# EAGLE design Adafruit BME280 (EAGLE 8.4.0)
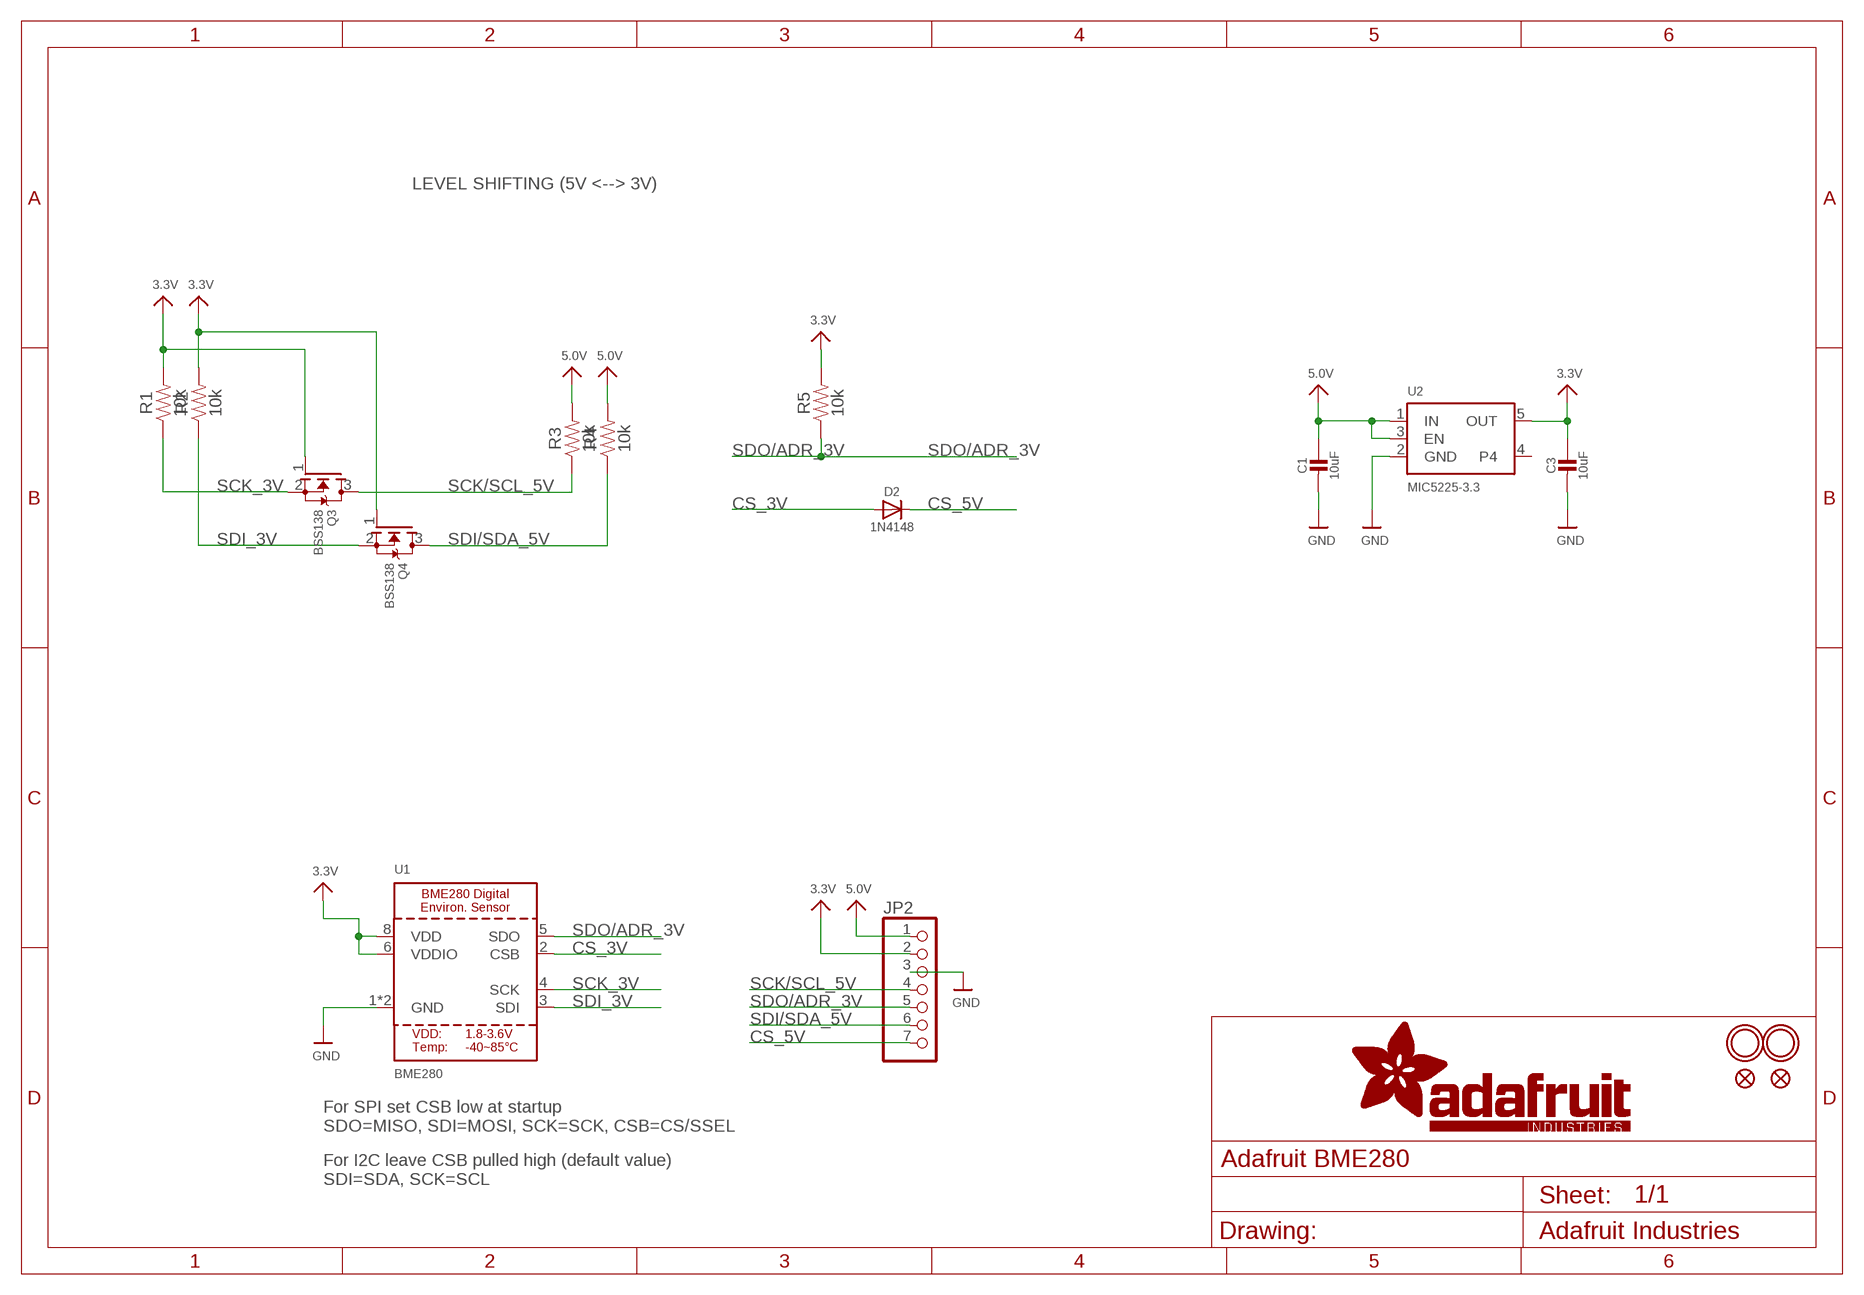
[diagram p0: schematic, sheet 1]

## Parts
C1  10uF  CAP_CERAMIC0805-NOOUTLINE  [0805-NO]
C3  10uF  CAP_CERAMIC0805-NOOUTLINE  [0805-NO]
D2  1N4148  DIODESOD-323  [SOD-323]
JP2  HEADER-1X770MIL  [1X07_ROUND_70]
Q3  BSS138  MOSFET-NWIDE  [SOT23-WIDE]
Q4  BSS138  MOSFET-NWIDE  [SOT23-WIDE]
R1  10k  10KOHM-0603-1/10W-1%  [0603]
R2  10k  10KOHM-0603-1/10W-1%  [0603]
R3  10k  10KOHM-0603-1/10W-1%  [0603]
R4  10k  10KOHM-0603-1/10W-1%  [0603]
R5  10k  10KOHM-0603-1/10W-1%  [0603]
U1  BME280  [BME280]
U2  MIC5225-3.3  VREG_SOT23-5  [SOT23-5]
U$5  FIDUCIAL""  [FIDUCIAL_1MM]
U$7  MOUNTINGHOLE2.0  [MOUNTINGHOLE_2.0_PLATED]
U$8  MOUNTINGHOLE2.0  [MOUNTINGHOLE_2.0_PLATED]
U$15  FIDUCIAL""  [FIDUCIAL_1MM]

## Nets
3.3V: C3.1 JP2.2 Q3.1(G) Q4.1(G) R1.2 R2.2 R5.2 U1.6(VDDIO) U1.8(VDD) U2.5(OUT)
5.0V: C1.1 JP2.1 R3.2 R4.2 U2.1(IN) U2.3(EN)
CS_3V: D2.A U1.2(CSB)
CS_5V: D2.C JP2.7
GND: C1.2 C3.2 JP2.3 U1.1(GND) U1.7(GND) U2.2(GND)
SCK/SCL_5V: JP2.4 Q3.3(D) R3.1
SCK_3V: Q3.2(S) R1.1 U1.4(SCK)
SDI/SDA_5V: JP2.6 Q4.3(D) R4.1
SDI_3V: Q4.2(S) R2.1 U1.3(SDI)
SDO/ADR_3V: JP2.5 R5.1 U1.5(SDO)
Unconnected: U2.4

## Notes on the sheet
- LEVEL SHIFTING (5V <--> 3V)
- For SPI set CSB low at startup
  SDO=MISO, SDI=MOSI, SCK=SCK, CSB=CS/SSEL
- For I2C leave CSB pulled high (default value)
  SDI=SDA, SCK=SCL

## Library data of the parts
C1 C3 = microbuilder:CAP_CERAMIC: Ceramic Capacitors For new designs, use the packages preceded by an '_' character since they are more reliable: The following footprints should be used on most boards: _0402 - Standard footprint for regular board layouts _0603 - Standard footprint for regular board layouts _0805 - Standard footprint for regular board layouts _1206 - Standard footprint for regular board layouts For extremely tight-pitch boards where space is at a premium, the following 'micro-pitch' footprints can be used (smaller pads, no silkscreen outline, etc.): _0402MP - Micro-pitch footprint for very dense/compact boards _0603MP - Micro-pitch footprint for very dense/compact boards _0805MP - Micro-pitch footprint for very dense/compact boards _1206MP - Micro-pitch footprint for very dense/compact boards
D2 = microbuilder:DIODE: Diode SMA Model Volts Amps Type Vf Ir Digikey # Notes SSA34-E3 40V 3A Schottky 480mV @ 3A 200uA @ 40V SSA34-E3/61TGITR-ND CDBA120-G 20V 1A Schottky 500mV @ 1A 500uA @ 20V 641-1014-6-ND REEL MBRA210 10V 2A Schottky 350mV @ 2A 700uA @ 10V MBRA210LT3 SOD-123 Model Volts Amps Type Vf Ir Order # Notes BAT54T1G 30V 200mA Schottky 800mV @ 200mA 2uA @ 25V BAT54T1GOSTR-ND B0530W 30V 500mA Schottky 430mV @ 500mA 130uA @ 30V B0530W-FDICT-ND REEL MBR120 20V 1A Schottky 340mV @ 1A MBR120VLSFT1GOSCT-ND SOD-323 Model Volts Amps Type Vf Ir Order # Notes PMEG2005EJ 20V 500mA Schottky 355mV @ 500mA 568-4110-1-ND ZLLS410 10V 570mA Schottky 380mV @ 570mA ZLLS410CT-ND 1N4148WS 75V 150mA Silicon/Simple 1V 1N4148WSFSCT-ND REEL SOD-523 Model Volts Amps Type Vf Ir Order # Notes BAT54XV2 30V 200mA Schottky 0.8V @ 100mA BAT54XV2CT-ND TB751S 30V 30mA Schottky RB751S-40TE61CT-ND SOT23-R/W (R = Solder Paste/Reflow Ovens, W = Hand-Soldering) Model Volts Amps Type Vf Ir Order # Notes BAT54FILM 40V 300mA Schottky 497-7162-1-ND POWERDI-5 Model Volts Amps Type Vf Ir Order # Notes PDS560 60V 5A Schottky 670mV @ 5A 150uA @ 60V PDS560DICT-ND
JP2 = microbuilder:HEADER-1X7: PIN HEADER
Q3 Q4 = microbuilder:MOSFET-N: N-Channel Mosfet LEGEND VDS: Voltage Drain-Source ID: Drain Current RDS(ON): Drain-Source On-State Resistance VGS(TH): Gate-Source Threshold Voltage CISS: Drain-Source Input Capacitance SOT-23 Name VDS ID RDS(ON) VGS(TH) CISS Order Number 2N7002E 60V 260mA 2.5 Ohm 2.5V @ 250uA 26.7pF @ 25V 2N7002ET1GOSTR-ND BSH103 30V 850mA 400 mOhm 400mV @ 1mA 83pF @ 24V BSH103,235-ND BSS138 60V 320mA 1.6 Ohm 1.5V @ 250uA 50pF @ 10V Mouser: 771-BSS138PW115 DMN2075U-7 20V 4.2A 38 mOhm 1V @ 250 uA 594.3pF @ 10V DMN2075U-7DICT-ND * BSS138 good choice for I2C level-shifting POWERPAK 1212-8 Name VDS ID RDS(ON) VGS(TH) CISS Order Number Si7308DN 60V 6A 58 mOhm 3V @ 250uA 665pF @ 15V SI7308DN-T1-E3CT-ND
R1-R5 = SparkFun-Resistors:10KOHM: 10kΩ resistor A resistor is a passive two-terminal electrical component that implements electrical resistance as a circuit element. Resistors act to reduce current flow, and, at the same time, act to lower voltage levels within circuits. - Wikipedia; PROD_ID: RES-00824
U1 = microbuilder:BME280: BME280 - Environmental Sensor (I2C + SPI)
U2 = microbuilder:VREG_SOT23-5: SOT23-5 Fixed Voltage Regulators Part Current Out V Out V In V Dropout θJA (°C/W) TJ (°C) Digikey Part No. ADP121 150mA 3.3V 3.4-5.5V 0.09V @ 150mA -- -- ADP121-AUJZ33R7CT-ND ADP121 150mA 3.0V 3.1-5.5V 0.09V @ 150mA -- -- ADP121-AUJZ30R7CT-ND ADP122 300mA 3.3V 3.4-5.5V 0.085V @ 300mA -- -- ADP122AUJZ-3.3-R7CT-ND ADP1712 300mA 3.3V 3.5-5.5V 0.17V @ 300mA -- -- ADP1712AUJZ-3.3-R7TR-ND AP7311 (Low Cost) 150mA 3.3V 3.5-6V 0.15V @ 150mA -- -- AP7311-33WG-7DICT-ND LD39015M18R 150mA 1.8V 1.9V-5.5V 0.08V @ 100mA -- -- 497-6977-1-ND LP2985A-33DBVR 150mA 3.3V 3.3-16V 0.28V @ 150mA 206 150 296-18479-1-ND MCP1824T-3302E/OT 300mA 3.3V 3.5V-6V 0.2V @ 300mA -- -- MCP1824T-3302E/OTCT-ND MIC5205-2.5YM5 TR 150mA 2.5V 2.7-16V 0.165V @ 150mA -- -- 576-1257-2-ND MIC5205-3.0YM5 TR 150mA 3.0V 3.2V-16V 0.165V @ 150mA -- -- 576-1258-2-ND MIC5205-3.3YM5 TR 150mA 3.3V 3.5V-16V 0.165V @ 150mA -- -- 576-1259-2-ND TPS780330220 150mA 3.3V+2.2V 3.6-5.5V 250mV Max -- -- 296-23332-1-ND TDA3663/N1,135 100mA 3.3V 3.5-45V 0.18V @ 50mA -- -- 568-5343-1-ND Max operating temp can be calculated using θJA, TJ (max junction temperature), and power in watts. Set the "Maximum Ambient Temperature" until it reaches TJ ("Max Junction Temperature"), which is the absolute limit for safe use of the regulator: Heat Sink Temperature Calculator <http://www.daycounter.com/Calculators/Heat-Sink-Temperature-Calculator.phtml> For example, With 12V source into a 3.3V LP2985 and a 30mA load, we are dissipating (12V-3.3V) * 0.03A = 0.261W. With a θJA of 206 °C/W, a TJ of 150°C, and 261mW we can safely use the chip without a heat sink up to 75°C (=147.1°C Junction Temperature).
U$5 U$15 = microbuilder:FIDUCIAL: Fiducial Alignment Points Various fiducial points for machine vision alignment.; BOM: EXCLUDE
U$7 U$8 = microbuilder:MOUNTINGHOLE: Mounting Hole For #2 screws (0.086"/2.18mm width, 0.094"/2.4mm hole) use 2.5mm; BOM: EXCLUDE

## Board
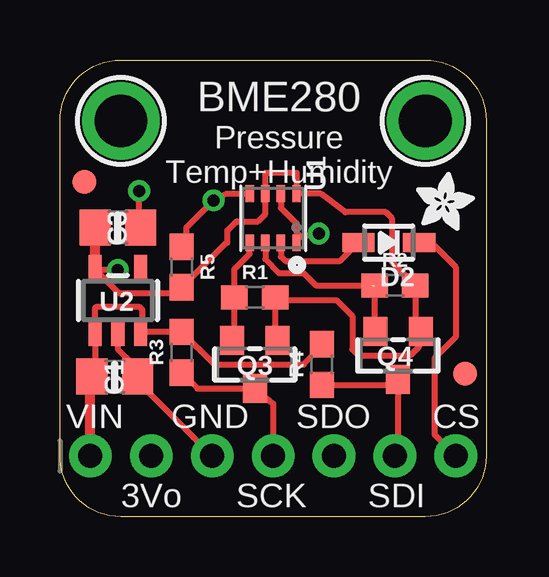
[diagram p1: board, top side]
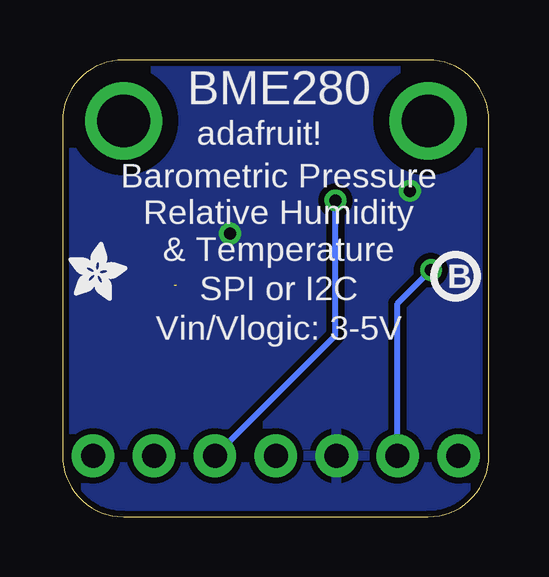
[diagram p2: board, bottom side, seen from below]

Size 17.78 x 19.05 mm. Coordinates in mm from the lower left corner, seen from the top.
Outline: 15.24,0 2.54,0 arc-90 0,2.54 0,16.51 arc-90 2.54,19.05 15.24,19.05 arc-90 17.78,16.51 17.78,2.54 arc-90 15.24,0
Copper layers (1*16): Top 0.035mm / dielectric 1.5mm / Bottom 0.035mm
Design rules "adafruit": minimum track width 8mil, minimum drill 15.5mil, track to track 8mil, track to pad 8mil, pad to pad 8mil, via to via 8mil, smd to smd 8mil, copper to edge 10mil, drill to drill 8mil, minimum pad ring 10mil, minimum via ring 8mil, stop-mask expansion 2mil, vias tented up to drill 20mil, thermal gap 10mil

### Footprints (pad centres in the part's own frame; a part is rotated, then mirrored left to right if it is on the bottom)
0805-NO = smd 1.3 x 1.5: 1 -0.95,0; 2 0.95,0
SOD-323 = smd 1.35 x 0.8: A 1.27,0; C -1.27,0
1X07_ROUND_70 = drill 1 pad 1.778: 1 -7.62,0; 2 -5.08,0; 3 -2.54,0; 4 0,0; 5 2.54,0; 6 5.08,0; 7 7.62,0
SOT23-WIDE = smd 1 x 1.2: 1 -0.95,-1; 2 0.95,-1; 3 0,1
0603 = smd 1.1 x 1: 1 -0.85,0; 2 0.85,0
BME280 = smd 0.7 x 0.35: 1 1.025,0.975; 2 1.025,0.325; 3 1.025,-0.325; 4 1.025,-0.975; 5 -1.025,-0.975; 6 -1.025,-0.325; 7 -1.025,0.325; 8 -1.025,0.975
SOT23-5 = smd 0.55 x 1.2: 1 -0.95,-1.3; 2 0,-1.3; 3 0.95,-1.3; 4 0.95,1.3; 5 -0.95,1.3
FIDUCIAL_1MM = smd 1 x 1: 1 0,0
MOUNTINGHOLE_2.0_PLATED = drill 2.2 pad 3: P$1 0,0

### Placement (x,y rotation side)
C1  2.29,5.84 0 top
C3  2.41,12.06 0 top
D2  13.72,11.43 180 top
JP2  8.89,2.54 0 top
Q3  8.13,6.35 180 top
Q4  14.1,6.73 180 top
R1  8.13,9.14 0 top
R2  13.97,9.65 0 top
R3  5.08,6.86 90 top
R4  10.92,6.35 90 top
R5  5.08,10.41 270 top
U1  8.89,12.45 270 top
U2  2.41,9.02 0 top
U$2  [ADAFRUIT_2.5MM]  17.53,9.02 0 bottom
U$5  1.02,13.97 0 top
U$6  [ADAFRUIT_2.5MM]  14.86,11.94 0 top
U$7  2.54,16.51 0 top
U$8  15.24,16.51 0 top
U$15  16.89,5.97 0 top
U$20  [PCBFEAT-REV-040]  1.4,10.03 0 bottom

### Tracks (layer width: path | path; a pad name or v marks a point on that pad's centre or on a via)
3.3V  (via drill 0.5)
  Top 0.254: v2.41,10.29 1.49,10.29 U2.5 2.45,9.34 4.85,9.34 R5.2 6.95,11.43 6.99,11.43 6.99,11.94 7.37,12.32 8.26,12.32 8.56,12.63 U1.6 8.56,14.35 9.87,14.35 U1.8 10.88,13.47 11.91,12.7 13.59,12.7 13.84,12.45 13.84,10.63 R2.2 14.82,7.96 Q4.1 14.99,7.67 14.99,7.11 14.61,6.73 12.45,6.73 12.19,6.99 12.19,8.38 11.56,9.02 9.11,9.02 R1.2 8.98,7.45 Q3.1
  Top 0.406: U2.5 C3.1
  Bottom 0.254: JP2.2 3.81,8.89 v2.41,10.29
5.0V
  Top 0.254: 3.43,7.78 3.43,8.64 3.3,8.76 1.52,8.76 1.46,8.7 U2.1 1.46,5.84 C1.1 1.27,5.84 1.27,5.65 | 3.43,7.78 U2.3 R3.2 6.44,6.35 10.16,6.35 10.92,7.11 R4.2 | 3.43,7.78 3.45,7.81
  Top 0.406: JP2.1 1.27,5.65
CS_3V
  Top 0.254: U1.2 9.21,10.85 9.4,10.67 11.68,10.67 D2.A
CS_5V
  Top 0.254: D2.C 15.49,11.43 16.51,10.41 16.51,7.49 15.62,6.6 15.62,3.43 JP2.7
GND  (via drill 0.5)
  Top 0.254: U1.7 9.21,12.88 9.87,12.23 9.87,11.86 | 9.87,11.86 U1.1 | C3.2 3.3,12.13 v3.3,13.59 | U2.2 2.41,6.99 3.05,6.35 3.05,6.03 C1.2 3.24,5.65 JP2.3 | 9.87,11.86 10.04,11.68 v10.79,11.81
  Bottom 0.254: v3.3,13.59 3.17,13.72 3.05,13.72 | v10.79,11.81 11.05,11.68
  pour Bottom (isolate 0.254): 0,19.05 17.78,19.05 17.91,0 0.13,0
SCK/SCL_5V
  Top 0.254: JP2.4 8.89,4.71 Q3.3 5.74,5.35 R3.1
SCK_3V
  Top 0.254: U1.4 7.92,10.96 7.28,10.33 R1.1 7.28,7.45 Q3.2
SDI/SDA_5V
  Top 0.254: 14.1,5.59 Q4.3 14.05,5.65 | 14.1,5.59 14.1,2.67 JP2.6 | R4.1 14.01,5.5 14.1,5.59
SDI_3V  (1 unrouted)
  Top 0.254: U1.3 8.56,10.74 9.14,10.16 10.16,10.16 10.67,9.65 13.02,9.65 | R2.1 13.12,7.76 Q4.2
SDO/ADR_3V  (via drill 0.5)
  Top 0.254: U1.5 6.93,13.47 v6.4,13.19 5.27,12.06 5.27,11.46 R5.1
  Bottom 0.254: JP2.5 6.4,7.57 v6.4,13.19

### Text on the board
tPlace: BME280 | Pressure / Temp+Humidity | VIN | GND | SDO | CS | 3Vo | SCK | SDI
bPlace: BME280 | adafruit! | Barometric Pressure / Relative Humidity / & Temperature | SPI or I2C | Vin/Vlogic: 3-5V